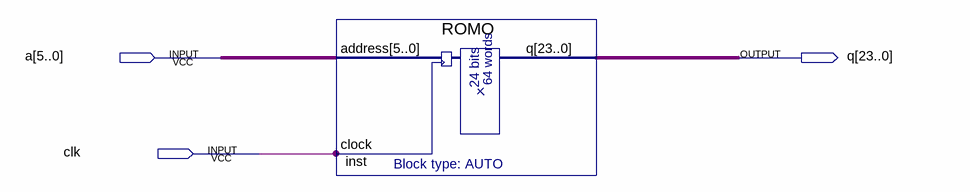
[diagram p0: schematic sheet]
// Quartus schematic ROM1.bdf as structural Verilog: 1 symbols, 3 pins
module ROM1 (
  input  [5:0] a,
  input  clk,
  output [23:0] q
);

  ROMO inst (.address(a), .clock(clk), .q(q));
endmodule
